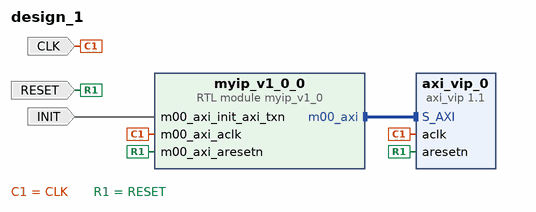
[diagram p0: block diagram of the top level]
# Vivado block design design_1, xczu3eg-sbva484-1-i, Vivado 2020.1
create_bd_design design_1

create_bd_port -dir I -type clk CLK
create_bd_port -dir I -type rst RESET
create_bd_port -dir I INIT

create_bd_cell -type ip -vlnv xilinx.com:ip:axi_vip:1.1 axi_vip_0
set_property -dict {CONFIG.INTERFACE_MODE SLAVE} [get_bd_cells axi_vip_0]
create_bd_cell -type module -reference myip_v1_0 myip_v1_0_0

# ---- connections ----

connect_bd_intf_net [get_bd_intf_pins myip_v1_0_0/m00_axi] [get_bd_intf_pins axi_vip_0/S_AXI]
connect_bd_net -net m00_axi_aclk_0_1 [get_bd_ports CLK] [get_bd_pins myip_v1_0_0/m00_axi_aclk] [get_bd_pins axi_vip_0/aclk]
connect_bd_net -net m00_axi_aresetn_0_1 [get_bd_ports RESET] [get_bd_pins myip_v1_0_0/m00_axi_aresetn] [get_bd_pins axi_vip_0/aresetn]
connect_bd_net -net m00_axi_init_axi_txn_0_1 [get_bd_ports INIT] [get_bd_pins myip_v1_0_0/m00_axi_init_axi_txn]

validate_bd_design
save_bd_design
